# Altium schematic sheet 电源板.SchDoc
size A4
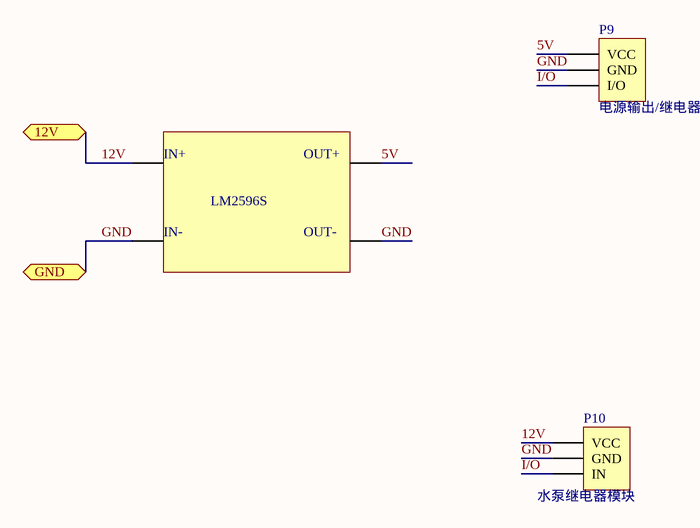
[diagram p0: 电源板.SchDoc]

## Parts
P9  Comment|READONL: 电源输出/继电器输入  [HDR1X3]
P10  水泵继电器模块  [MHDR1X3]

## Ports
12V, GND

## Nets
5V: P9.1(VCC)
12V: P10.1(VCC) ; port 12V
GND: P9.2(GND) P10.2(GND) ; port GND
I/O: P9.3(I/O) P10.3(IN)

## Notes on the sheet
- IN+
- OUT+
- IN-
- LM2596S
- OUT-

## Library data of the parts
P9 = Header 3: Header, 3-Pin; LatestRevisionDate: 17-Jul-2002; LatestRevisionNote: Re-released for DXP Platform.; Publisher: Altium Limited
P10 = MHDR1X3: Header, 3-Pin; LatestRevisionDate: 17-Jul-2002; LatestRevisionNote: Re-released for DXP Platform.; Publisher: Altium Limited